# EAGLE schematic Garoa_Dojo_Shield (EAGLE 6.2)
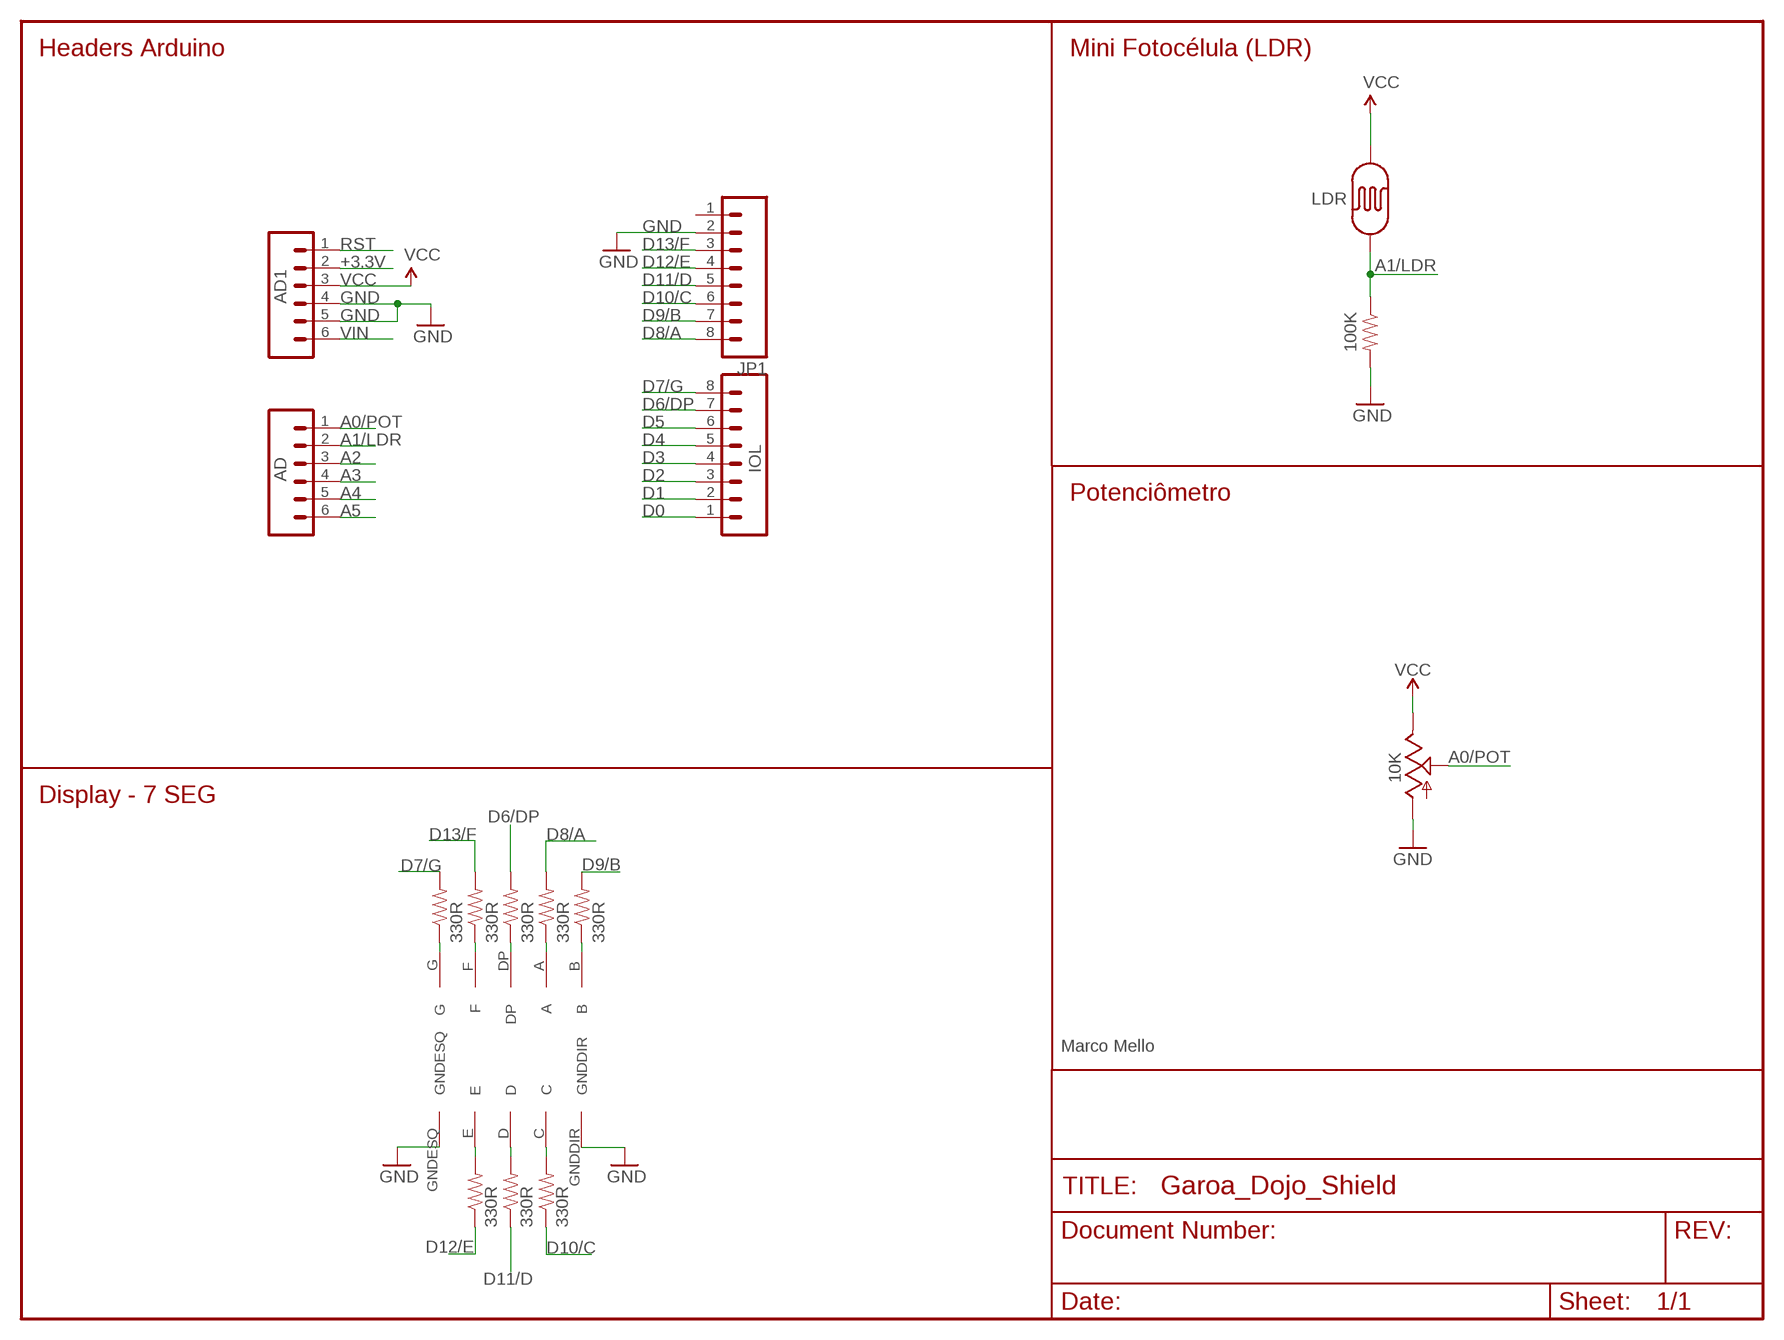
[diagram p0: schematic, sheet 1]

## Parts
AD  M06SIP  [1X06]
AD1  M06SIP  [1X06]
IOL  M08  [1X08]
JP1  M081X08  [1X08]
R1  LDR  PHOTOCELLPTH  [PHOTOCELL]
R2  330R  RESISTORKIT  [AXIAL-0.3-KIT]
R3  330R  RESISTORKIT  [AXIAL-0.3-KIT]
R4  330R  RESISTORKIT  [AXIAL-0.3-KIT]
R5  330R  RESISTORKIT  [AXIAL-0.3-KIT]
R6  330R  RESISTORKIT  [AXIAL-0.3-KIT]
R7  330R  RESISTORKIT  [AXIAL-0.3-KIT]
R8  330R  RESISTORKIT  [AXIAL-0.3-KIT]
R9  330R  RESISTORKIT  [AXIAL-0.3-KIT]
R10  100K  RESISTORKIT  [AXIAL-0.3-KIT]
U$1  10K  POT-RV16AF-20  [POT_ALPHA_RV16AF-20]
U$2  7SEG-CODINGDOJO  [7SEG-CODINGDOJO]

## Nets
+3.3V: AD1.2
A0/POT: AD.1 U$1.2(S)
A1/LDR: AD.2 R1.1 R10.P$1
A2: AD.3
A3: AD.4
A4: AD.5
A5: AD.6
D0: IOL.1
D1: IOL.2
D2: IOL.3
D3: IOL.4
D4: IOL.5
D5: IOL.6
D6/DP: IOL.7 R4.P$2
D7/G: IOL.8 R2.P$2
D8/A: JP1.8 R5.P$2
D9/B: JP1.7 R6.P$2
D10/C: JP1.6 R7.P$1
D11/D: JP1.5 R8.P$1
D12/E: JP1.4 R9.P$1
D13/F: JP1.3 R3.P$2
GND: AD1.4 AD1.5 JP1.2 R10.P$2 U$1.1(A) U$2.GNDDIR U$2.GNDESQ
N$2: R9.P$2 U$2.E
N$3: R8.P$2 U$2.D
N$4: R7.P$2 U$2.C
N$5: R2.P$1 U$2.G
N$7: R3.P$1 U$2.F
N$8: R4.P$1 U$2.DP
N$9: R5.P$1 U$2.A
N$10: R6.P$1 U$2.B
RST: AD1.1
VCC: AD1.3 R1.2 U$1.3(E)
VIN: AD1.6
Unconnected: JP1.1

## Notes on the sheet
- Headers Arduino | Mini Fotocélula (LDR)
- Potenciômetro
- Display - 7 SEG
- Marco Mello

## Library data of the parts
AD AD1 = SparkFun:M06: Header 6 Standard 6-pin 0.1" header. Use with straight break away headers (SKU : PRT-00116), right angle break away headers (PRT-00553), swiss pins (PRT-00743), machine pins (PRT-00117), and female headers (PRT-00115). Molex polarized connector foot print use with SKU : PRT-08094 with associated crimp pins and housings. NOTES ON THE VARIANTS LOCK and LOCK_LONGPADS... This footprint was designed to help hold the alignment of a through-hole component (i.e. 6-pin header) while soldering it into place. You may notice that each hole has been shifted either up or down by 0.005 of an inch from it's more standard position (which is a perfectly straight line). This slight alteration caused the pins (the squares in the middle) to touch the edges of the holes. Because they are alternating, it causes a "brace" to hold the component in place. 0.005 has proven to be the perfect amount of "off-center" position when using our standard breakaway headers. Although looks a little odd when you look at the bare footprint, once you have a header in there, the alteration is very hard to notice. Also, if you push a header all the way into place, it is covered up entirely on the bottom side. This idea of altering the position of holes to aid alignment will be further integrated into the Sparkfun Library for other footprints. It can help hold any component with 3 or more connection pins.
IOL = SparkFun:M08: Header 8 Standard 8-pin 0.1" header. Use with straight break away headers (SKU : PRT-00116), right angle break away headers (PRT-00553), swiss pins (PRT-00743), machine pins (PRT-00117), and female headers (PRT-00115).
JP1 = SparkFun-Connectors:M08: Header 8 Standard 8-pin 0.1" header. Use with straight break away headers (SKU : PRT-00116), right angle break away headers (PRT-00553), swiss pins (PRT-00743), machine pins (PRT-00117), and female headers (PRT-00115).
R1 = SparkFun-Sensors:PHOTOCELL: CdS photoresistor. This is a low cost way to detect light levels. Resistance decreases with more incoming light. SparkFun SKU: SEN-09088
R2-R10 = SparkFun-Resistors:RESISTOR: Resistor Basic schematic elements and footprints for 0603, 1206, and PTH resistors.
U$1 = SparkFun-Electromechanical:POT
U$2 = 7segCodingDojo:7SEG-CODINGDOJO